# EAGLE design AT88SC12816C (EAGLE 6.4)
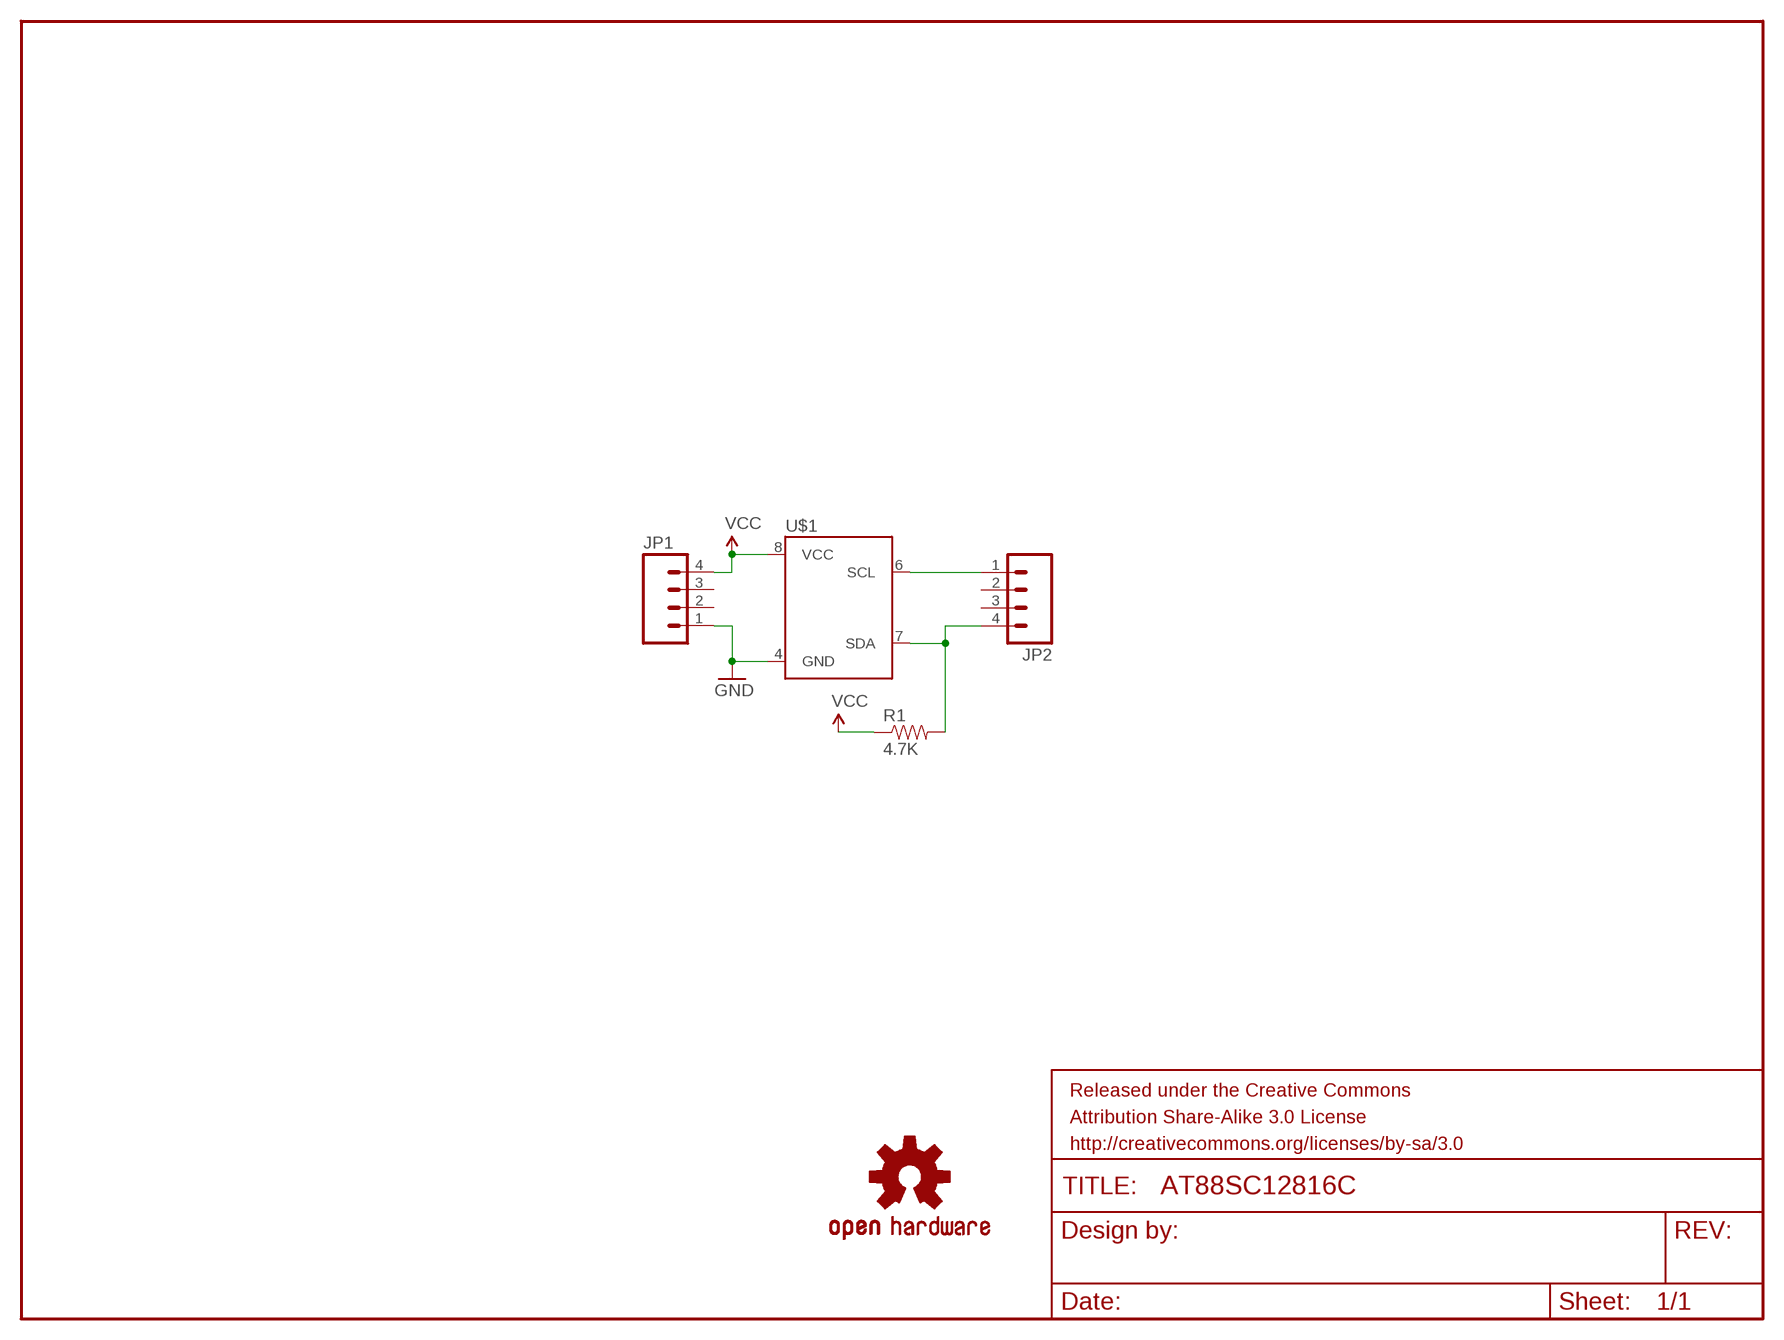
[diagram p0: schematic, sheet 1]

## Parts
FRAME1  FRAME-LETTER  [CREATIVE_COMMONS]
JP1  M04LOCK  [1X04_LOCK]
JP2  M04LOCK  [1X04_LOCK]
LOGO1  OSHW-LOGOM  [OSHW-LOGO-M]
R1  4.7K  RESISTORPTH-1/4W  [AXIAL-0.4]
U$1  AT88SCAT88SC-PDIP  [DIL08]

## Nets
GND: JP1.1 U$1.4(GND)
N$1: JP2.4 R1.P$2 U$1.7(SDA)
N$3: JP2.1 U$1.6(SCL)
VCC: JP1.4 R1.P$1 U$1.8(VCC)
Unconnected: JP1.2 JP1.3 JP2.2 JP2.3

## Library data of the parts
FRAME1 = SparkFun-Aesthetics:FRAME-LETTER: Schematic Frame Standard 8.5x11 US Letter frame
JP1 JP2 = SparkFun-Connectors:M04: Header 4 Standard 4-pin 0.1" header. Use with straight break away headers (SKU : PRT-00116), right angle break away headers (PRT-00553), swiss pins (PRT-00743), machine pins (PRT-00117), and female headers (PRT-00115). Molex polarized connector foot print use with SKU : PRT-08231 with associated crimp pins and housings. 1MM SMD Version SKU: PRT-10208
LOGO1 = SparkFun-Aesthetics:OSHW-LOGO: Open Source Hardware Logo This logo indicates the piece of hardware it is found on incorporates a OSHW license and/or adheres to the definition of open source hardware found here: http://freedomdefined.org/OSHW
R1 = SparkFun-Passives:RESISTOR: Resistor Basic schematic elements and footprints for 0603, 1206, and PTH resistors.
U$1 = EEPROM:AT88SC

## Board
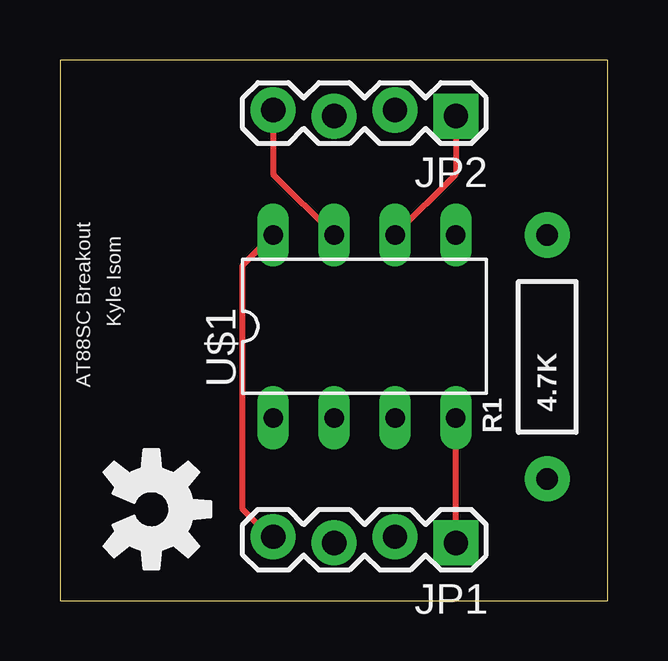
[diagram p1: board, top side]
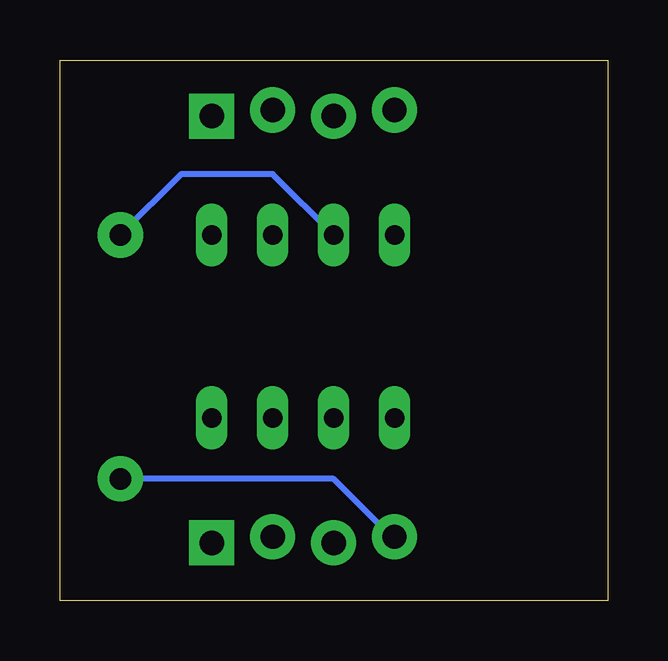
[diagram p2: board, bottom side, seen from below]

Size 22.84 x 22.53 mm. Coordinates in mm from the lower left corner, seen from the top.
Outline: 0,0 22.84,0 22.84,22.53 0,22.53 0,0
Copper layers (1*16): Top 0.035mm / dielectric 1.5mm / Bottom 0.035mm
Design rules "default": minimum track width 10mil, minimum drill 24mil, track to track 8mil, track to pad 8mil, pad to pad 8mil, via to via 8mil, smd to smd 8mil, copper to edge 40mil, drill to drill 8mil, minimum pad ring 10mil, minimum via ring 8mil, stop-mask expansion 4mil, vias tented up to drill 0mil, thermal gap 10mil

### Footprints (pad centres in the part's own frame; a part is rotated, then mirrored left to right if it is on the bottom)
1X04_LOCK = drill 1.016 pad 1.88 square: 1 0,0.127 | drill 1.016 pad 1.88: 2 2.54,-0.127; 3 5.08,0.127; 4 7.62,-0.127
AXIAL-0.4 = drill 0.9 pad 1.88: P$1 -5.08,0; P$2 5.08,0
DIL08 = drill 0.813 long: 1 -3.81,-3.81; 2 -1.27,-3.81; 3 1.27,-3.81; 4 3.81,-3.81; 5 3.81,3.81; 6 1.27,3.81; 7 -1.27,3.81; 8 -3.81,3.81

### Placement (x,y rotation side)
FRAME1  -2.54,-8.89 0 top  (outside the outline)
JP1  16.51,2.54 180 top
JP2  16.51,20.32 180 top
LOGO1  3.81,3.81 270 top
R1  20.32,10.16 90 top
U$1  12.7,11.43 0 top

### Tracks (layer width: path | path; a pad name or v marks a point on that pad's centre or on a via)
GND
  Top 0.254: JP1.1 U$1.4
N$1
  Top 0.254: U$1.7 8.89,17.78 JP2.4
  Bottom 0.254: R1.P$2 17.78,17.78 13.97,17.78 U$1.7
N$3
  Top 0.254: U$1.6 16.51,17.78 JP2.1 16.51,20.32
VCC
  Top 0.254: U$1.8 7.62,13.97 7.62,3.81 8.89,2.54 JP1.4
  Bottom 0.254: R1.P$1 11.43,5.08 8.89,2.54 JP1.4

### Text on the board
tPlace: Kyle Isom | AT88SC Breakout